# EAGLE design M_G_ext_motor_tssop (EAGLE 9.6.2)
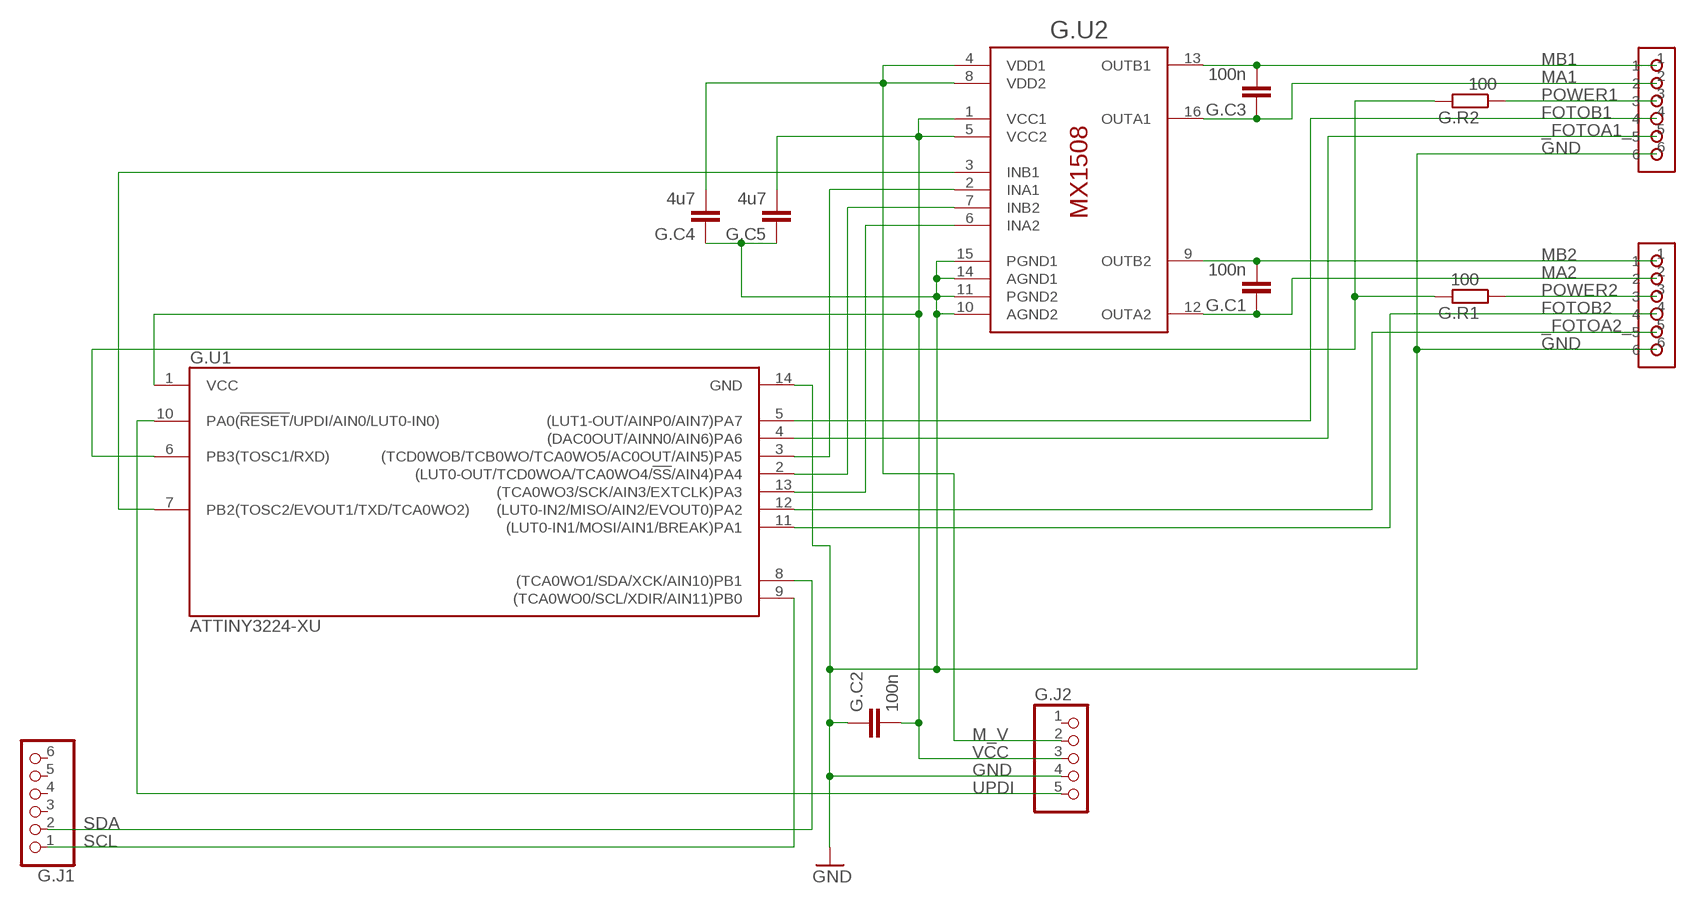
[diagram p0: schematic, sheet 1]

## Parts
G.C1  100n  C-EUC0603  [C0603]
G.C2  100n  C-EUC0603  [C0603]
G.C3  100n  C-EUC0603  [C0603]
G.C4  4u7  C-EUC0603  [C0603]
G.C5  4u7  C-EUC0603  [C0603]
G.J1  PINHD-1X6  [1X06]
G.J2  PINHD-1X5  [1X05]
G.J3  A1250WR-6  [A1250WR-6]
G.MOTO1  A1250WR-6  [A1250WR-6]
G.R1  100  R-EU_R0603  [R0603]
G.R2  100  R-EU_R0603  [R0603]
G.U1  ATTINY3224-XU  [TSSOP14]
G.U2  MX1508  [SOP16]

## Nets
_FOTOA1_: G.MOTO1.5 G.U1.4((DAC0OUT/AINN0/AIN6)PA6)
_FOTOA2_: G.J3.5 G.U1.12((LUT0-IN2/MISO/AIN2/EVOUT0)PA2)
FOTOB1: G.MOTO1.4 G.U1.5((LUT1-OUT/AINP0/AIN7)PA7)
FOTOB2: G.J3.4 G.U1.11((LUT0-IN1/MOSI/AIN1/BREAK)PA1)
GND: G.C2.1 G.C4.1 G.C5.1 G.J2.4 G.J3.6 G.MOTO1.6 G.U1.14(GND) G.U2.10(AGND2) G.U2.11(PGND2) G.U2.14(AGND1) G.U2.15(PGND1)
INA1: G.U1.3((TCD0WOB/TCB0WO/TCA0WO5/AC0OUT/AIN5)PA5) G.U2.2(INA1)
INA2: G.U1.13((TCA0WO3/SCK/AIN3/EXTCLK)PA3) G.U2.6(INA2)
INB1: G.U1.7(PB2(TOSC2/EVOUT1/TXD/TCA0WO2)) G.U2.3(INB1)
INB2: G.U1.2((LUT0-OUT/TCD0WOA/TCA0WO4/!SS!/AIN4)PA4) G.U2.7(INB2)
M_V: G.C4.2 G.J2.2 G.U2.4(VDD1) G.U2.8(VDD2)
MA1: G.C3.1 G.MOTO1.2 G.U2.16(OUTA1)
MA2: G.C1.1 G.J3.2 G.U2.12(OUTA2)
MB1: G.C3.2 G.MOTO1.1 G.U2.13(OUTB1)
MB2: G.C1.2 G.J3.1 G.U2.9(OUTB2)
POWER1: G.MOTO1.3 G.R2.1
POWER2: G.J3.3 G.R1.1
POWER_LED: G.R1.2 G.R2.2 G.U1.6(PB3(TOSC1/RXD))
SCL: G.J1.1 G.U1.9((TCA0WO0/SCL/XDIR/AIN11)PB0)
SDA: G.J1.2 G.U1.8((TCA0WO1/SDA/XCK/AIN10)PB1)
UPDI: G.J2.5 G.U1.10(PA0(!RESET!/UPDI/AIN0/LUT0-IN0))
VCC: G.C2.2 G.C5.2 G.J2.3 G.U1.1(VCC) G.U2.1(VCC1) G.U2.5(VCC2)
Unconnected: G.J1.3 G.J1.4 G.J1.5 G.J1.6 G.J2.1

## Power pins joined to a net without a drawn wire
GND: G.J3.$1(GND) G.J3.$2(GND) G.MOTO1.$1(GND) G.MOTO1.$2(GND)

## Library data of the parts
G.C1-G.C5 = rcl:C-EU: CAPACITOR, European symbol; SPICEPREFIX: C
G.J1 = pinhead2:PINHD-1X6: PIN HEADER
G.J2 = pinhead2:PINHD-1X5: PIN HEADER
G.J3 G.MOTO1 = hugo:A1250WR-6
G.R1 G.R2 = rcl:R-EU_: RESISTOR, European symbol; SPICEPREFIX: R
G.U1 = ATTINY412-SSN:ATTINY3224-XU
G.U2 = hugo:MX1508

## Board
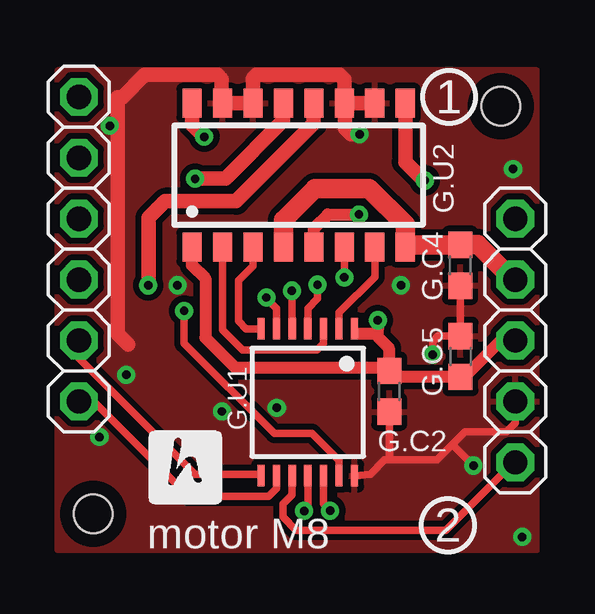
[diagram p1: board, top side]
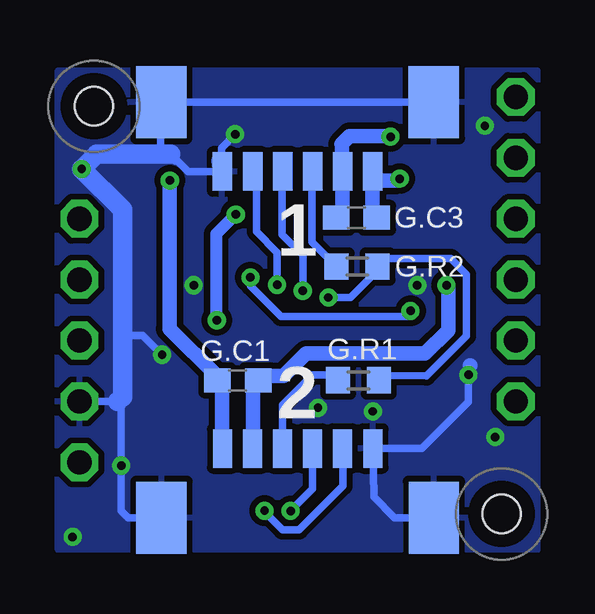
[diagram p2: board, bottom side, seen from below]

No outline drawn. Coordinates in mm, seen from the top.
Copper layers (1*16): Top 0.035mm / dielectric 1.5mm / Bottom 0.035mm
Design rules "default *": minimum track width 12mil, minimum drill 0.35mm, track to track 10mil, track to pad 10mil, pad to pad 10mil, via to via 10mil, smd to smd 10mil, copper to edge 15mil, drill to drill 10mil, minimum pad ring 10mil, minimum via ring 8mil, stop-mask expansion 4mil, vias tented up to drill 0mil, thermal gap 10mil
Holes 1.6 mm at 2,2 19,19
tRestrict: area 18,18 to 20,20; area 1,1 to 3,3
bRestrict: area 1,1 to 3,3; area 18,18 to 20,20

### Footprints (pad centres in the part's own frame; a part is rotated, then mirrored left to right if it is on the bottom)
C0603 = smd 1.1 x 1: 1 -0.85,0; 2 0.85,0
1X06 = drill 1.016 pad 1.575 octagon: 1 -6.35,0; 2 -3.81,0; 3 -1.27,0; 4 1.27,0; 5 3.81,0; 6 6.35,0
1X05 = drill 1.016 pad 1.575 octagon: 1 -5.08,0; 2 -2.54,0; 3 0,0; 4 2.54,0; 5 5.08,0
A1250WR-6 = smd 0.8 x 1.6: 1 -3.128,2.54; 2 -1.878,2.54; 3 -0.628,2.54; 4 0.622,2.54; 5 1.872,2.54; 6 3.142,2.54 | smd 2.1 x 3: $1 -5.678,-0.34; $2 5.682,-0.34
R0603 = smd 1 x 1.1: 1 -0.85,0; 2 0.85,0
TSSOP14 = smd 0.3 x 0.9: 1 -1.95,-3.06; 2 -1.3,-3.06; 3 -0.65,-3.06; 4 0,-3.06; 5 0.65,-3.06; 6 1.3,-3.06; 7 1.95,-3.06; 8 1.95,3.06; 9 1.3,3.06; 10 0.65,3.06; 11 0,3.06; 12 -0.65,3.06; 13 -1.3,3.06; 14 -1.95,3.06
SOP16 = smd 0.8 x 1.2: 1 -4.445,-3; 2 -3.175,-3; 3 -1.905,-3; 4 -0.635,-3; 5 0.635,-3; 6 1.905,-3; 7 3.175,-3; 8 4.445,-3; 9 4.445,3; 10 3.175,3; 11 1.905,3; 12 0.635,3; 13 -0.635,3; 14 -1.905,3; 15 -3.175,3; 16 -4.445,3

### Placement (x,y rotation side)
G.C1  13,7.57 180 bottom
G.C2  14.35,7.11 90 top
G.C3  8.05,14.35 0 bottom
G.C4  17.3,12.37 90 top
G.C5  17.32,8.56 270 top
G.J1  1.4,13.04 90 top
G.J2  19.6,9.23 270 top
G.J3  10.5,2.18 0 bottom
G.MOTO1  10.5,18.82 180 bottom
G.R1  7.97,7.57 0 bottom
G.R2  8.02,12.32 0 bottom
G.U1  10.95,6.65 180 top
G.U2  10.57,16.13 0 top

### Tracks (layer width: path | path; a pad name or v marks a point on that pad's centre or on a via)
_FOTOA1_  (via drill 0.35)
  Top 0.305: G.U1.4 10.95,10.57 11.35,10.97 v11.35,11.56
  Bottom 0.305: G.MOTO1.5 12.37,16.25 12.22,16.1 12.22,13.77 11.35,12.9 v11.35,11.56
_FOTOA2_  (via drill 0.35)
  Top 0.305: G.U1.12 11.6,2.42 v11.88,2.13
  Bottom 0.305: G.J3.5 8.61,4.71 8.61,3.18 10.45,1.34 11.14,1.34 11.88,2.08 v11.88,2.13
FOTOB1  (via drill 0.35)
  Top 0.305: G.U1.5 v10.3,11.29 v10.29,11.3
  Bottom 0.305: G.MOTO1.4 11.15,16.25 11.15,13.66 10.29,12.79 v10.29,11.3
FOTOB2  (via drill 0.35)
  Top 0.305: G.U1.11 10.95,2.28 v10.79,2.12
  Bottom 0.305: G.J3.4 9.88,3.04 v10.79,2.12
GND  (via drill 0.35)
  Top 0.305: G.C4.1 17.32,11.51 G.C5.1 16.37,9.41 16.15,9.2 v16.15,8.64 | 19.6,6.3 G.J2.4 19.6,5.79 19.23,5.42 17.5,5.42 16.98,4.89 | G.U1.14 13.56,3.65 14.15,4.25 14.35,4.25 | G.C2.1 14.35,4.25 | 14.35,4.25 16.33,4.25 16.98,4.89 | 16.98,4.89 v17.86,4.01
  Top 0.61: G.U2.11 G.U2.10 | G.U2.11 12.47,20.12 12.27,20.32 8.81,20.32 8.66,20.17 G.U2.14 G.U2.15 7.36,19.16 7.36,20.13 7.18,20.31 4.15,20.31 3.22,19.38 3.02,19.38 3.02,9.51 3.46,9.07 | G.U2.11 12.5,19.1 12.5,18.09 12.75,17.83 v13.11,17.83
  Bottom 0.305: 15.51,1.84 17.58,1.84 17.86,2.12 v17.86,4.01 17.86,6.83 | 15.58,16.79 15.58,16.71 16.21,17.35 16.21,19.16 5.49,19.16 | 3.31,8.18 3.31,7.87 v3.38,7.8 3.38,6.66 5.32,4.72 G.J3.6 7.33,2.71 6.46,1.84 4.79,1.84 | v13.11,17.83 13.68,17.26 G.MOTO1.6 15.07,16.28 15.58,16.79 | 15.58,16.79 15.8,17.01 | 18.01,6.68 G.J2.4 | v16.15,8.64 16.97,9.45 17.8,9.45
  Bottom 0.61: 3.31,8.18
  Bottom 0.813: 15.8,17.01 18.88,17.01 v19.51,16.38 17.8,14.68 17.8,9.45 17.8,6.88 17.86,6.83 18.01,6.68 | 13.7,16.71 13.68,16.69 G.MOTO1.6
  other vias: 2.26,5.21 14.83,11.53 19.89,1.04 9.65,6.43 7.37,6.27 2.69,18.19 5.51,11.53
  pour Top (isolate 0.254): 0.5,20.5 0.5,0.5 20.5,0.5 20.5,20.5
  pour Bottom (isolate 0.254): 0.5,20.5 0.5,0.5 20.5,0.5 20.5,20.5
INA1
  Top 0.305: G.U2.2 7.4,9.67 8.23,8.84 11.33,8.84 11.6,9.11 G.U1.3
INA2  (via drill 0.35)
  Top 0.305: v5.79,10.47 v5.79,10.46 5.79,9.12 9.55,5.36 11.13,5.36 12.25,4.24 G.U1.13 | G.U2.6 v12.47,11.86
  Bottom 0.305: v12.47,11.86 12.47,11.51 11.2,10.24 5.92,10.24 5.79,10.37 v5.79,10.47
INB1
  Top 0.305: 8.65,12.6 G.U2.3 8.66,12.34 8.05,11.73 8.05,10.04 8.38,9.71 8.39,9.71 G.U1.7
INB2
  Top 0.305: G.U2.7 13.74,11.89 12.25,10.39 G.U1.2
M_V
  Top 0.813: G.U2.4 9.93,14.25 11.25,15.57 13.5,15.57 15.01,14.06 G.U2.8 15.01,13.28 15.07,13.22 G.C4.2 17.32,13.24 18.03,13.24 19.5,11.77 G.J2.2
MA1  (via drill 0.35)
  Top 0.61: G.U2.16 6.12,18.24 v6.63,17.73
  Bottom 0.61: v6.63,17.73 6.82,17.73 6.85,17.75 8.33,17.75 8.67,17.41 8.65,17.39 G.MOTO1.2 8.62,14.62 G.C3.1
MA2  (via drill 0.35)
  Top 0.61: v4.29,11.53 4.32,11.56 4.32,14.35 5,15.04 7.96,15.04 11.2,18.27 G.U2.12
  Bottom 0.61: v4.29,11.53 4.22,11.46 4.22,9.66 5.19,8.69 10.14,8.69 11.08,7.75 11.97,7.75 G.C1.1 12.36,7.22 12.36,4.73 G.J3.2
MB1  (via drill 0.35)
  Top 0.61: v6.25,15.98 7.51,15.98 9.93,18.39 G.U2.13
  Bottom 0.61: 7.36,15.59 7.41,15.61 G.MOTO1.1 | v6.25,15.98 6.33,15.9 7.37,15.9 G.MOTO1.1 | G.MOTO1.1 7.37,14.34 7.37,14.35 G.C3.2
MB2  (via drill 0.35)
  Top 0.61: v15.83,15.9 15.78,15.9 15.01,16.68 G.U2.9
  Bottom 0.61: v15.83,15.9 v15.84,15.89 15.84,9.72 13.85,7.72 G.C1.2 13.65,7.57 13.65,4.78 G.J3.1
POWER1
  Bottom 0.305: G.MOTO1.3 9.9,16.26 9.9,13.34 G.R2.1
POWER2
  Bottom 0.305: G.J3.3 11.13,6.54 9.88,7.79 9.04,7.8 G.R1.1
POWER_LED  (via drill 0.35)
  Top 0.305: G.U1.6 9.65,10.57 9.22,11 v9.22,11.02
  Bottom 0.305: v9.22,11.02 | v9.22,11.02 8.31,11.02 7.17,12.16 G.R2.2 6.84,12.65 4.12,12.65 3.46,11.99 3.46,9.41 5.13,7.74 6.88,7.78 G.R1.2
SCL
  Top 0.305: G.J1.1 2.05,6.66 5.98,2.73 9.3,2.73 9.65,3.07 G.U1.9
SDA
  Top 0.305: G.J1.2 1.4,8.49 6.24,3.65 8.99,3.65 G.U1.8
UPDI
  Top 0.305: G.J2.5 19.54,4.15 16.72,1.32 10.46,1.32 9.91,1.88 9.91,2.41 10.3,2.8 G.U1.10
VCC  (via drill 0.35)
  Top 0.305: 12.94,9.67 G.U1.1 13.1,9.51 | 13.64,9.51 13.86,9.73 13.88,9.75
  Top 0.508: G.U2.1 6.12,12.37 6.68,11.81 6.68,9.35 7.92,8.1 14.21,8.1 G.C2.2 | G.U2.5 11.21,13.91 11.78,14.49 v13.08,14.49 | G.J2.3 18.99,9.23 17.48,7.71 G.C5.2 14.71,7.71 14.45,7.96 G.C2.2 | v13.87,10.08 13.86,10.07 13.86,9.73 | 13.64,9.51 13.1,9.51 | G.C2.2 14.33,7.99 14.33,8.93 13.88,9.38 13.88,9.75
  Bottom 0.508: v13.08,14.49 13.89,13.68 13.89,10.1 v13.87,10.08

### Text on the board
tPlace: 1 | motor M8 | 2
bNames: 1 | 2